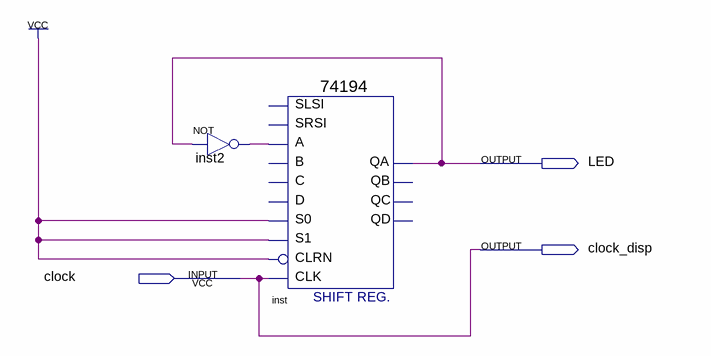
[diagram p0: schematic sheet]
// Quartus schematic LEDFSM.bdf as structural Verilog: 2 symbols, 3 pins
module LEDFSM (
  input  clock,
  output LED,
  output clock_disp
);

  wire inst2_out;

  not inst2 (inst2_out, LED);
  \74194  inst (
    .CLK(clock), .CLRN(1'b1), .S1(1'b1), .S0(1'b1), .A(inst2_out), .QA(LED));  // open: SLSI, SRSI, B, C, D, QB, QC, QD

  assign clock_disp = clock;
endmodule
